# EAGLE design xc6xl9 (EAGLE 7.2.0)
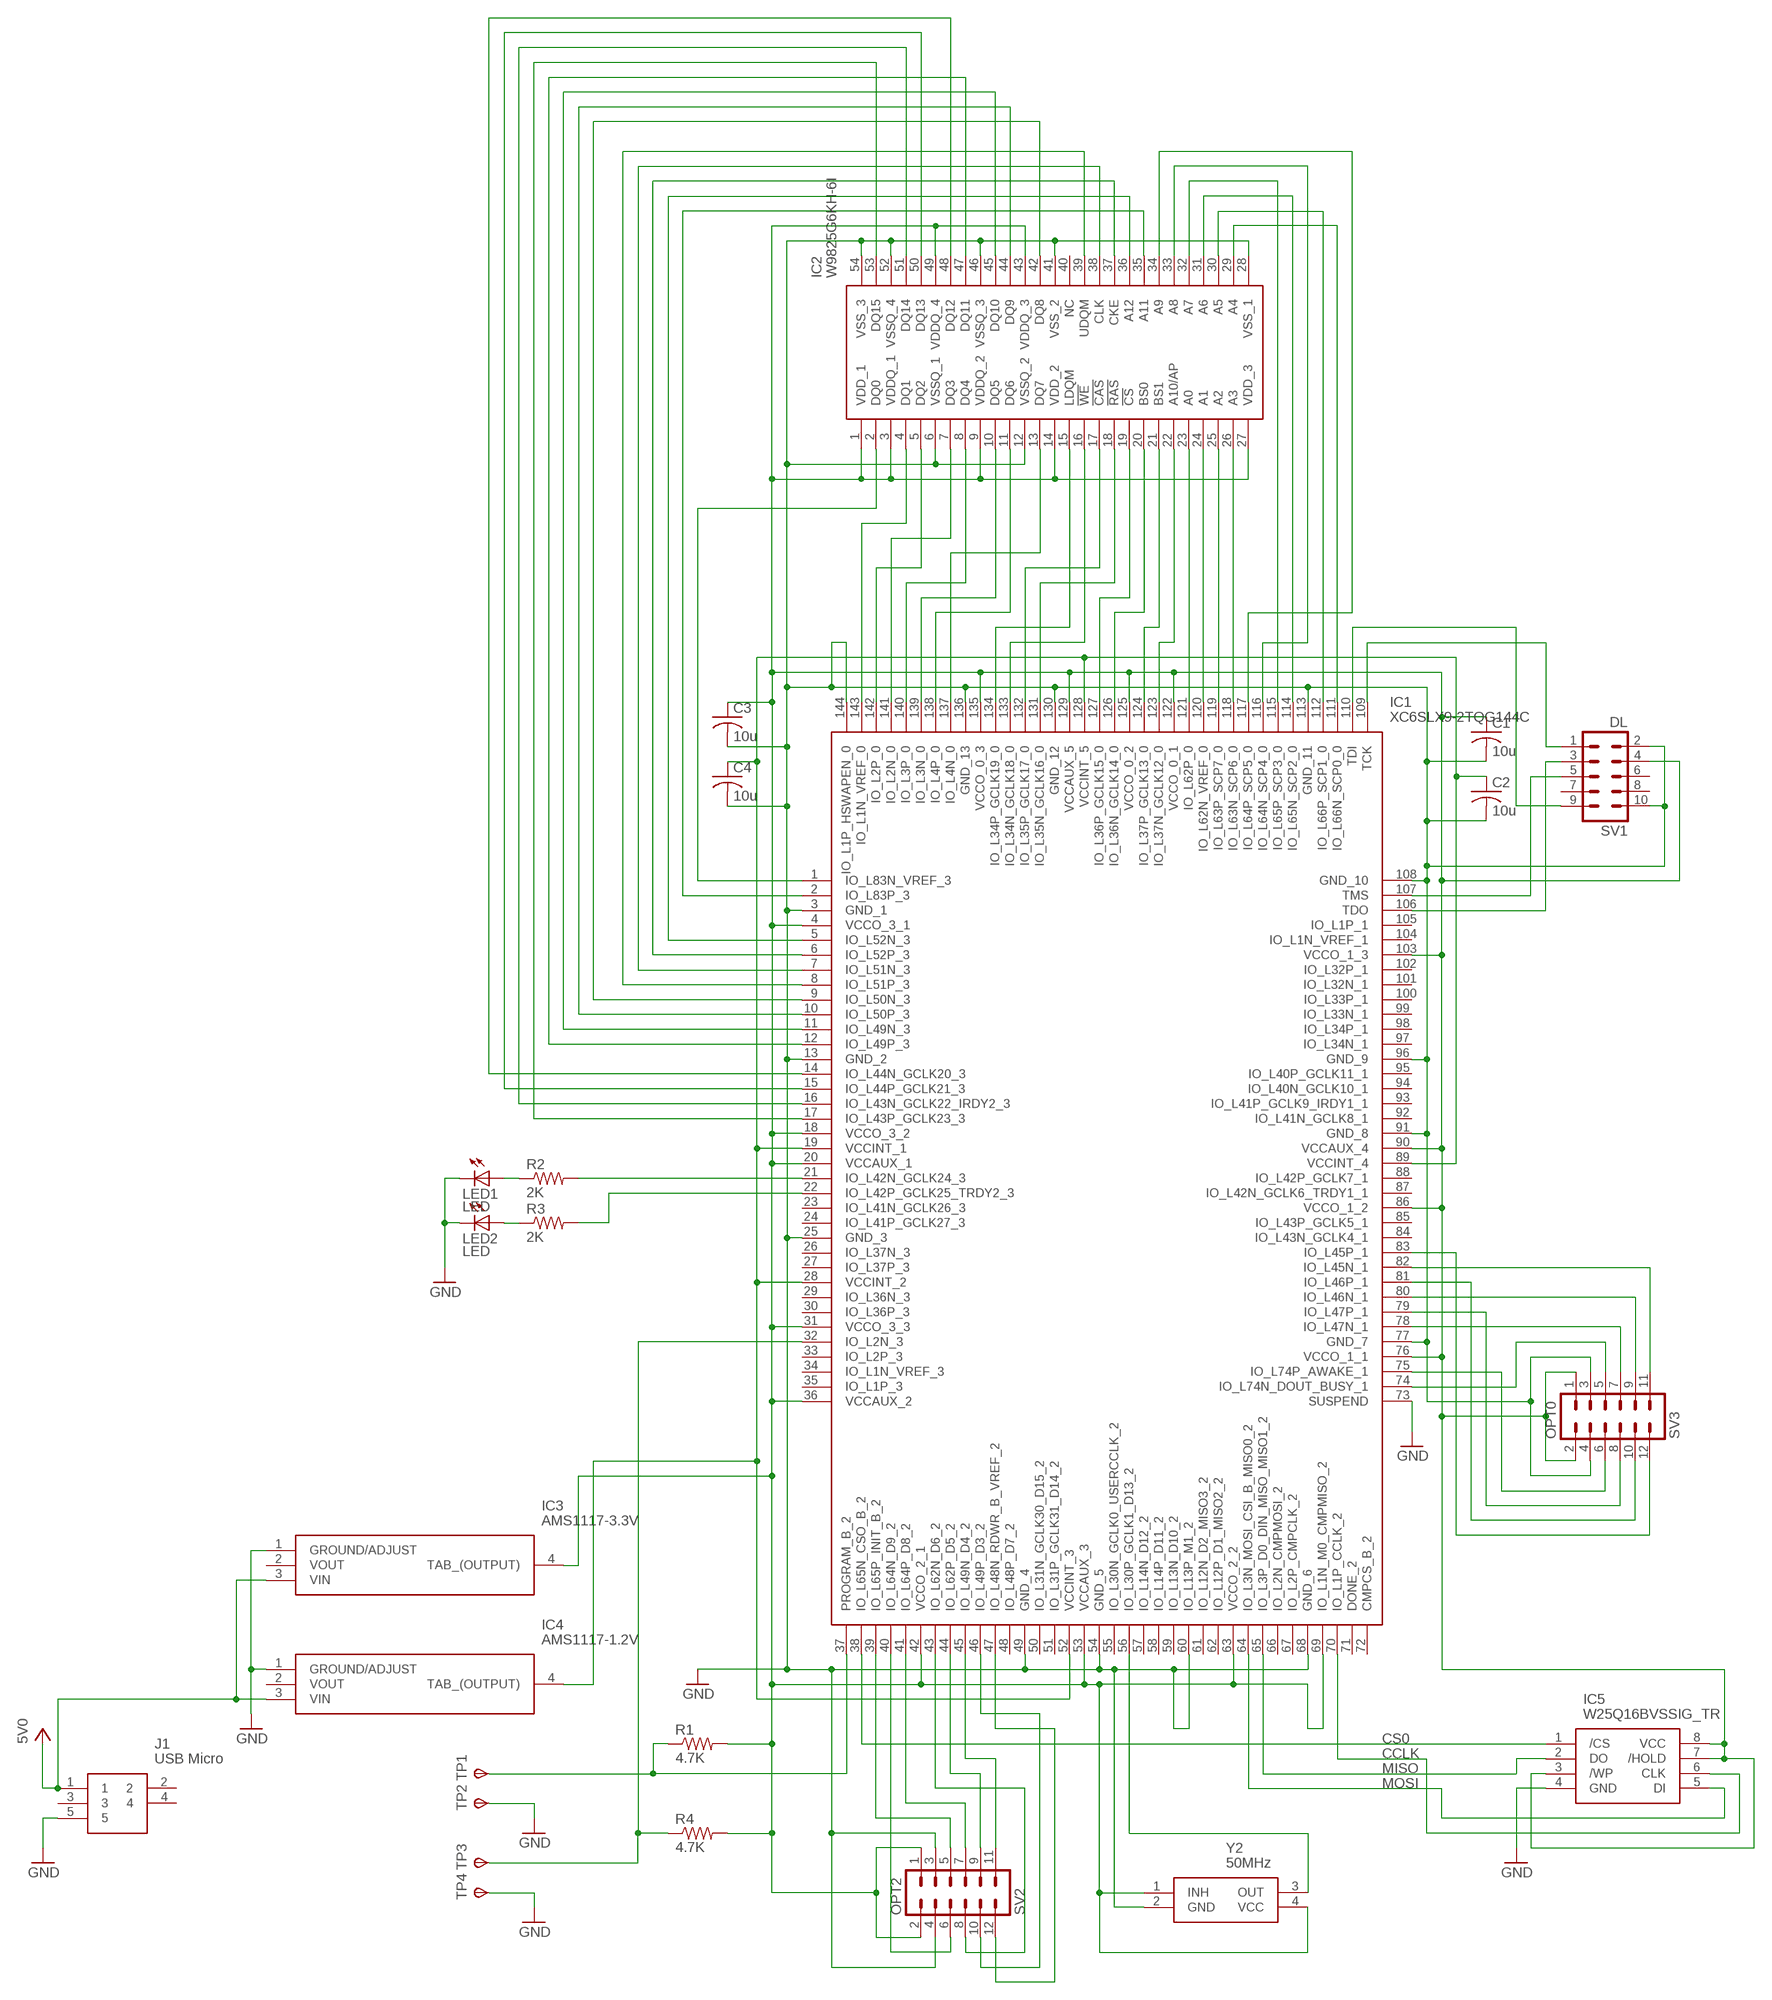
[diagram p0: schematic, sheet 1]

## Parts
C1  10u  C-USC0805K  [C0805K]
C2  10u  C-USC0805K  [C0805K]
C3  10u  C-USC0805K  [C0805K]
C4  10u  C-USC0805K  [C0805K]
IC1  XC6SLX9-2TQG144C  [QFP50P2200X2200X160-144N]
IC2  W9825G6KH-6I  [SOP80P1176X120-54N]
IC3  AMS1117-3.3V  [SOT229P700X180-4N]
IC4  AMS1117-1.2V  AMS1117-3.3V  [SOT229P700X180-4N]
IC5  W25Q16BVSSIG_TR  [SOIC127P790X216-8N]
J1  USB Micro  10104110-0001LF  [10104110-0001LF]
LED1  LED  LEDCHIPLED_0805  [CHIPLED_0805]
LED2  LED  LEDCHIPLED_0805  [CHIPLED_0805]
R1  4.7K  R-US_R0805  [R0805]
R2  2K  R-US_R0805  [R0805]
R3  2K  R-US_R0805  [R0805]
R4  4.7K  R-US_R0805  [R0805]
SV1  DL  MA05-2  [MA05-2]
SV2  OPT2  MA06-2  [MA06-2]
SV3  OPT0  MA06-2  [MA06-2]
TP1  TPSTP10SQ  [TP10SQ]
TP2  TPSTP10SQ  [TP10SQ]
TP3  TPSTP10SQ  [TP10SQ]
TP4  TPSTP10SQ  [TP10SQ]
Y2  50MHz  KC5032A80.0000C10E00  [KC5032A12.0000CM0E00]

## Nets
3V3: C1.1 C3.1 IC1.4(VCCO_3_1) IC1.18(VCCO_3_2) IC1.20(VCCAUX_1) IC1.31(VCCO_3_3) IC1.36(VCCAUX_2) IC1.42(VCCO_2_1) IC1.53(VCCAUX_3) IC1.63(VCCO_2_2) IC1.69(IO_L1N_M0_CMPMISO_2) IC1.76(VCCO_1_1) IC1.86(VCCO_1_2) IC1.90(VCCAUX_4) IC1.103(VCCO_1_3) IC1.122(VCCO_0_1) IC1.125(VCCO_0_2) IC1.129(VCCAUX_5) IC1.135(VCCO_0_3) IC2.1(VDD_1) IC2.3(VDDQ_1) IC2.9(VDDQ_2) IC2.14(VDD_2) IC2.27(VDD_3) IC2.43(VDDQ_3) IC2.49(VDDQ_4) IC3.4(TAB_(OUTPUT)) IC5.3(/WP) IC5.7(/HOLD) IC5.8(VCC) R1.2 R4.2 SV1.4 SV2.1 SV2.2 SV3.1 SV3.2 Y2.1(INH) Y2.4(VCC)
CCLK: IC1.70(IO_L1P_CCLK_2) IC5.6(CLK)
CS0: IC1.38(IO_L65N_CSO_B_2) IC5.1(/CS)
GND: C1.2 C2.2 C3.2 C4.2 IC1.3(GND_1) IC1.13(GND_2) IC1.25(GND_3) IC1.49(GND_4) IC1.54(GND_5) IC1.60(IO_L13P_M1_2) IC1.68(GND_6) IC1.73(SUSPEND) IC1.77(GND_7) IC1.91(GND_8) IC1.96(GND_9) IC1.108(GND_10) IC1.113(GND_11) IC1.130(GND_12) IC1.136(GND_13) IC1.144(IO_L1P_HSWAPEN_0) IC2.6(VSSQ_1) IC2.12(VSSQ_2) IC2.28(VSS_1) IC2.41(VSS_2) IC2.46(VSSQ_3) IC2.52(VSSQ_4) IC2.54(VSS_3) IC3.1(GROUND/ADJUST) IC4.1(GROUND/ADJUST) IC5.4(GND) J1.5 LED1.C LED2.C SV1.2 SV1.10 SV2.3 SV2.4 SV3.3 SV3.4 TP2.TP(PP) TP4.TP(PP) Y2.2(GND)
MISO: IC1.65(IO_L3P_D0_DIN_MISO_MISO1_2) IC5.2(DO)
MOSI: IC1.64(IO_L3N_MOSI_CSI_B_MISO0_2) IC5.5(DI)
N$1: IC1.56(IO_L30P_GCLK1_D13_2) Y2.3(OUT)
N$2: IC1.109(TCK) SV1.1
N$3: IC1.106(TDO) SV1.3
N$4: IC1.107(TMS) SV1.5
N$5: IC1.110(TDI) SV1.9
N$6: IC1.111(IO_L66N_SCP0_0) IC2.29(A4)
N$7: IC1.112(IO_L66P_SCP1_0) IC2.30(A5)
N$8: IC1.114(IO_L65N_SCP2_0) IC2.31(A6)
N$9: IC1.115(IO_L65P_SCP3_0) IC2.32(A7)
N$10: IC1.116(IO_L64N_SCP4_0) IC2.33(A8)
N$11: IC1.21(IO_L42N_GCLK24_3) R2.2
N$12: IC1.22(IO_L42P_GCLK25_TRDY2_3) R3.2
N$13: LED2.A R3.1
N$14: LED1.A R2.1
N$15: IC1.117(IO_L64P_SCP5_0) IC2.34(A9)
N$16: IC1.118(IO_L63N_SCP6_0) IC2.26(A3)
N$17: IC1.119(IO_L63P_SCP7_0) IC2.25(A2)
N$18: IC1.120(IO_L62N_VREF_0) IC2.24(A1)
N$19: IC1.121(IO_L62P_0) IC2.23(A0)
N$20: IC1.123(IO_L37N_GCLK12_0) IC2.22(A10/AP)
N$21: IC1.37(PROGRAM_B_2) R1.1 TP1.TP(PP)
N$22: IC1.124(IO_L37P_GCLK13_0) IC2.21(BS1)
N$23: IC1.126(IO_L36N_GCLK14_0) IC2.20(BS0)
N$24: IC1.127(IO_L36P_GCLK15_0) IC2.19(!CS)
N$25: IC1.131(IO_L35N_GCLK16_0) IC2.18(!RAS)
N$26: IC1.132(IO_L35P_GCLK17_0) IC2.17(!CAS)
N$27: IC1.133(IO_L34N_GCLK18_0) IC2.16(!WE)
N$28: IC1.134(IO_L34P_GCLK19_0) IC2.15(LDQM)
N$29: IC1.137(IO_L4N_0) IC2.13(DQ7)
N$30: IC1.138(IO_L4P_0) IC2.11(DQ6)
N$31: IC1.139(IO_L3N_0) IC2.10(DQ5)
N$32: IC1.140(IO_L3P_0) IC2.8(DQ4)
N$33: IC1.141(IO_L2N_0) IC2.7(DQ3)
N$34: IC1.142(IO_L2P_0) IC2.5(DQ2)
N$35: IC1.143(IO_L1N_VREF_0) IC2.4(DQ1)
N$36: IC1.2(IO_L83P_3) IC2.35(A11)
N$37: IC1.5(IO_L52N_3) IC2.36(A12)
N$38: IC1.6(IO_L52P_3) IC2.37(CKE)
N$39: IC1.7(IO_L51N_3) IC2.38(CLK)
N$40: IC1.8(IO_L51P_3) IC2.39(UDQM)
N$41: IC1.32(IO_L2N_3) R4.1 TP3.TP(PP)
N$42: IC1.9(IO_L50N_3) IC2.42(DQ8)
N$43: IC1.10(IO_L50P_3) IC2.44(DQ9)
N$44: IC1.11(IO_L49N_3) IC2.45(DQ10)
N$45: IC1.12(IO_L49P_3) IC2.47(DQ11)
N$46: IC1.17(IO_L43P_GCLK23_3) IC2.53(DQ15)
N$47: IC1.16(IO_L43N_GCLK22_IRDY2_3) IC2.51(DQ14)
N$48: IC1.15(IO_L44P_GCLK21_3) IC2.50(DQ13)
N$49: IC1.14(IO_L44N_GCLK20_3) IC2.48(DQ12)
N$52: IC1.74(IO_L74N_DOUT_BUSY_1) SV3.5
N$53: IC1.75(IO_L74P_AWAKE_1) SV3.6
N$54: IC1.78(IO_L47N_1) SV3.7
N$55: IC1.79(IO_L47P_1) SV3.8
N$56: IC1.80(IO_L46N_1) SV3.9
N$57: IC1.82(IO_L45N_1) SV3.11
N$58: IC1.81(IO_L46P_1) SV3.10
N$59: IC1.83(IO_L45P_1) SV3.12
N$60: IC1.39(IO_L65P_INIT_B_2) SV2.5
N$61: IC1.40(IO_L64N_D9_2) SV2.6
N$62: IC1.41(IO_L64P_D8_2) SV2.7
N$63: IC1.43(IO_L62N_D6_2) SV2.8
N$64: IC1.44(IO_L62P_D5_2) SV2.9
N$65: IC1.46(IO_L49P_D3_2) SV2.10
N$66: IC1.45(IO_L49N_D4_2) SV2.11
N$67: IC1.47(IO_L48N_RDWR_B_VREF_2) SV2.12
N$68: IC1.1(IO_L83N_VREF_3) IC2.2(DQ0)
VCC: IC3.3(VIN) IC4.3(VIN) J1.1 ; supply symbol labelled 5V0
VCCINT: C2.1 C4.1 IC1.19(VCCINT_1) IC1.28(VCCINT_2) IC1.52(VCCINT_3) IC1.89(VCCINT_4) IC1.128(VCCINT_5) IC4.4(TAB_(OUTPUT))
Unconnected: IC1.23(IO_L41N_GCLK26_3) IC1.24(IO_L41P_GCLK27_3) IC1.26(IO_L37N_3) IC1.27(IO_L37P_3) IC1.29(IO_L36N_3) IC1.30(IO_L36P_3) IC1.33(IO_L2P_3) IC1.34(IO_L1N_VREF_3) IC1.35(IO_L1P_3) IC1.48(IO_L48P_D7_2) IC1.50(IO_L31N_GCLK30_D15_2) IC1.51(IO_L31P_GCLK31_D14_2) IC1.55(IO_L30N_GCLK0_USERCCLK_2) IC1.57(IO_L14N_D12_2) IC1.58(IO_L14P_D11_2) IC1.59(IO_L13N_D10_2) IC1.61(IO_L12N_D2_MISO3_2) IC1.62(IO_L12P_D1_MISO2_2) IC1.66(IO_L2N_CMPMOSI_2) IC1.67(IO_L2P_CMPCLK_2) IC1.71(DONE_2) IC1.72(CMPCS_B_2) IC1.84(IO_L43N_GCLK4_1) IC1.85(IO_L43P_GCLK5_1) IC1.87(IO_L42N_GCLK6_TRDY1_1) IC1.88(IO_L42P_GCLK7_1) IC1.92(IO_L41N_GCLK8_1) IC1.93(IO_L41P_GCLK9_IRDY1_1) IC1.94(IO_L40N_GCLK10_1) IC1.95(IO_L40P_GCLK11_1) IC1.97(IO_L34N_1) IC1.98(IO_L34P_1) IC1.99(IO_L33N_1) IC1.100(IO_L33P_1) IC1.101(IO_L32N_1) IC1.102(IO_L32P_1) IC1.104(IO_L1N_VREF_1) IC1.105(IO_L1P_1) IC2.40(NC) IC3.2(VOUT) IC4.2(VOUT) J1.2 J1.3 J1.4 SV1.6 SV1.7 SV1.8

## Library data of the parts
C1-C4 = adafruit:C-US: CAPACITOR, American symbol
IC1 = XC6SLX9-2TQG144C:XC6SLX9-2TQG144C: FPGA Spartan-6 9152 logic cells TQFP144 XC6SLX9-2TQG144C, FPGA Spartan-6 9152 Cells, 576kbit, 5720 Blocks, 144-Pin TQFP Source: Datasheet <https://www.xilinx.com/support/documentation/data_sheets/ds160.pdf>; DESCRIPTION: FPGA Spartan-6 9152 logic cells TQFP144 XC6SLX9-2TQG144C, FPGA Spartan-6 9152 Cells, 576kbit, 5720 Blocks, 144-Pin TQFP; HEIGHT: 1.6mm; MANUFACTURER_NAME: XILINX; MANUFACTURER_PART_NUMBER: XC6SLX9-2TQG144C; MOUSER_PART_NUMBER: 1732079; MOUSER_PRICE-STOCK: http://uk.rs-online.com/web/p/products/1732079; RS_PART_NUMBER: 1732079; RS_PRICE-STOCK: http://uk.rs-online.com/web/p/products/1732079
IC2 = W9825G6KH-6I:W9825G6KH-6I: Winbond W9825G6KH-6I, SDRAM 256Mbit Surface Mount, 166MHz, 54-Pin TSOP Source: Datasheet <http://www.winbond.com/resource-files/w9825g6kh_a04.pdf>; DESCRIPTION: Winbond W9825G6KH-6I, SDRAM 256Mbit Surface Mount, 166MHz, 54-Pin TSOP; HEIGHT: 1.2mm; MANUFACTURER_NAME: Winbond; MANUFACTURER_PART_NUMBER: W9825G6KH-6I; MOUSER_PART_NUMBER: 454-W9825G6KH-6I; MOUSER_PRICE-STOCK: https://www.mouser.com/Search/Refine.aspx?Keyword=454-W9825G6KH-6I; RS_PART_NUMBER: 1882632; RS_PRICE-STOCK: http://uk.rs-online.com/web/p/products/1882632
IC3 IC4 = ams1117-3.3v:AMS1117-3.3V: 1A LOW DROPOUT VOLTAGE REGULATOR, SOT-223 Source: Datasheet <http://www.advanced-monolithic.com/pdf/ds1117.pdf>; DESCRIPTION: 1A LOW DROPOUT VOLTAGE REGULATOR, SOT-223; HEIGHT: 1.8mm; MANUFACTURER_NAME: Advanced Monolithic Systems; MANUFACTURER_PART_NUMBER: ams1117-3.3v
IC5 = W25Q16BVSSIG_TR:W25Q16BVSSIG_TR: IC FLASH 16M SPI 104MHZ 8SOIC Source: Datasheet <https://media.digikey.com/pdf/Data Sheets/Winbond PDFs/W25Q16BV.pdf>; ARROW_PART_NUMBER: W25Q16BVSSIG TR; DESCRIPTION: IC FLASH 16M SPI 104MHZ 8SOIC; HEIGHT: 2.16mm; MANUFACTURER_NAME: Winbond; MANUFACTURER_PART_NUMBER: W25Q16BVSSIG TR; MOUSER_PART_NUMBER: N/A; MOUSER_PRICE-STOCK: https://www.mouser.co.uk/ProductDetail/Winbond/W25Q16BVSSIG-TR?qs=rkhjVJ6%2F3EKjTa61MhmWkw%3D%3D
J1 = USB-Micro_3:10104110-0001LF: USB Connectors 5P Quick Connect Micro USB TypeB Rcpt Source: Datasheet <http://docs-emea.rs-online.com/webdocs/0ed1/0900766b80ed1ae6.pdf>; ALLIED_NUMBER: 70236824; ALLIED_PRICE-STOCK: http://www.alliedelec.com/fci-10104110-0001lf/70236824/; ARROW_PART_NUMBER: 10104110-0001LF; ARROW_PRICE-STOCK: https://www.arrow.com/en/products/10104110-0001lf/amphenol-fci; DESCRIPTION: USB Connectors 5P Quick Connect Micro USB TypeB Rcpt; HEIGHT: mm; MANUFACTURER_NAME: FCI; MANUFACTURER_PART_NUMBER: 10104110-0001LF; RS_PART_NUMBER: 1738645; RS_PRICE-STOCK: http://uk.rs-online.com/web/p/products/1738645
LED1 LED2 = adafruit:LED: LED OSRAM: - CHIPLED LG R971, LG N971, LY N971, LG Q971, LY Q971, LO R971, LY R971 LH N974, LH R974 LS Q976, LO Q976, LY Q976 LO Q996 - Hyper CHIPLED LW Q18S LB Q993, LB Q99A, LB R99A - SideLED LS A670, LO A670, LY A670, LG A670, LP A670 LB A673, LV A673, LT A673, LW A673 LH A674 LY A675 LS A676, LA A676, LO A676, LY A676, LW A676 LS A679, LY A679, LG A679 - Hyper Micro SIDELED® LS Y876, LA Y876, LO Y876, LY Y876 LT Y87S - SmartLED LW L88C, LW L88S LB L89C, LB L89S, LG L890 LS L89K, LO L89K, LY L89K LS L896, LA L896, LO L896, LY L896 - TOPLED LS T670, LO T670, LY T670, LG T670, LP T670 LSG T670, LSP T670, LSY T670, LOP T670, LYG T670 LG T671, LOG T671, LSG T671 LB T673, LV T673, LT T673, LW T673 LH T674 LS T676, LA T676, LO T676, LY T676, LB T676, LH T676, LSB T676, LW T676 LB T67C, LV T67C, LT T67C, LS T67K, LO T67K, LY T67K, LW E67C LS E67B, LA E67B, LO E67B, LY E67B, LB E67C, LV E67C, LT E67C LW T67C LS T679, LY T679, LG T679 LS T770, LO T770, LY T770, LG T770, LP T770 LB T773, LV T773, LT T773, LW T773 LH T774 LS E675, LA E675, LY E675, LS T675 LS T776, LA T776, LO T776, LY T776, LB T776 LHGB T686 LT T68C, LB T68C - Hyper Mini TOPLED® LB M676 - Mini TOPLED Santana® LG M470 LS M47K, LO M47K, LY M47K Source: http://www.osram.convergy.de/
R1-R4 = adafruit:R-US_: RESISTOR, American symbol
SV1 = con-lstb:MA05-2: PIN HEADER; OC_FARNELL: unknown; OC_NEWARK: unknown
SV2 SV3 = con-lstb:MA06-2: PIN HEADER; OC_FARNELL: unknown; OC_NEWARK: unknown
TP1-TP4 = testpad:TPS: TEST PIN
Y2 = OSC_KC5032A80.0000C10E00:KC5032A80.0000C10E00: KC5032A80.0000C10E00, Crystal Oscillator, 80 MHz, 50ppm CMOS 15pF, 4-Pin CSMD, 5 x 3.2 x 1mm Source: Datasheet <http://uk.rs-online.com/web/p/products/1110767>; DESCRIPTION: KC5032A80.0000C10E00, Crystal Oscillator, 80 MHz, 50ppm CMOS 15pF, 4-Pin CSMD, 5 x 3.2 x 1mm; HEIGHT: mm; MANUFACTURER_NAME: KYOCERA; MANUFACTURER_PART_NUMBER: KC5032A80.0000C10E00; MOUSER_PART_NUMBER: 1110767P; MOUSER_PRICE-STOCK: http://uk.rs-online.com/web/p/products/1110767P; RS_PART_NUMBER: 1110767P; RS_PRICE-STOCK: http://uk.rs-online.com/web/p/products/1110767P

## Net classes
0 default: width 0.25 mm, clearance 0.004 mm

## Board
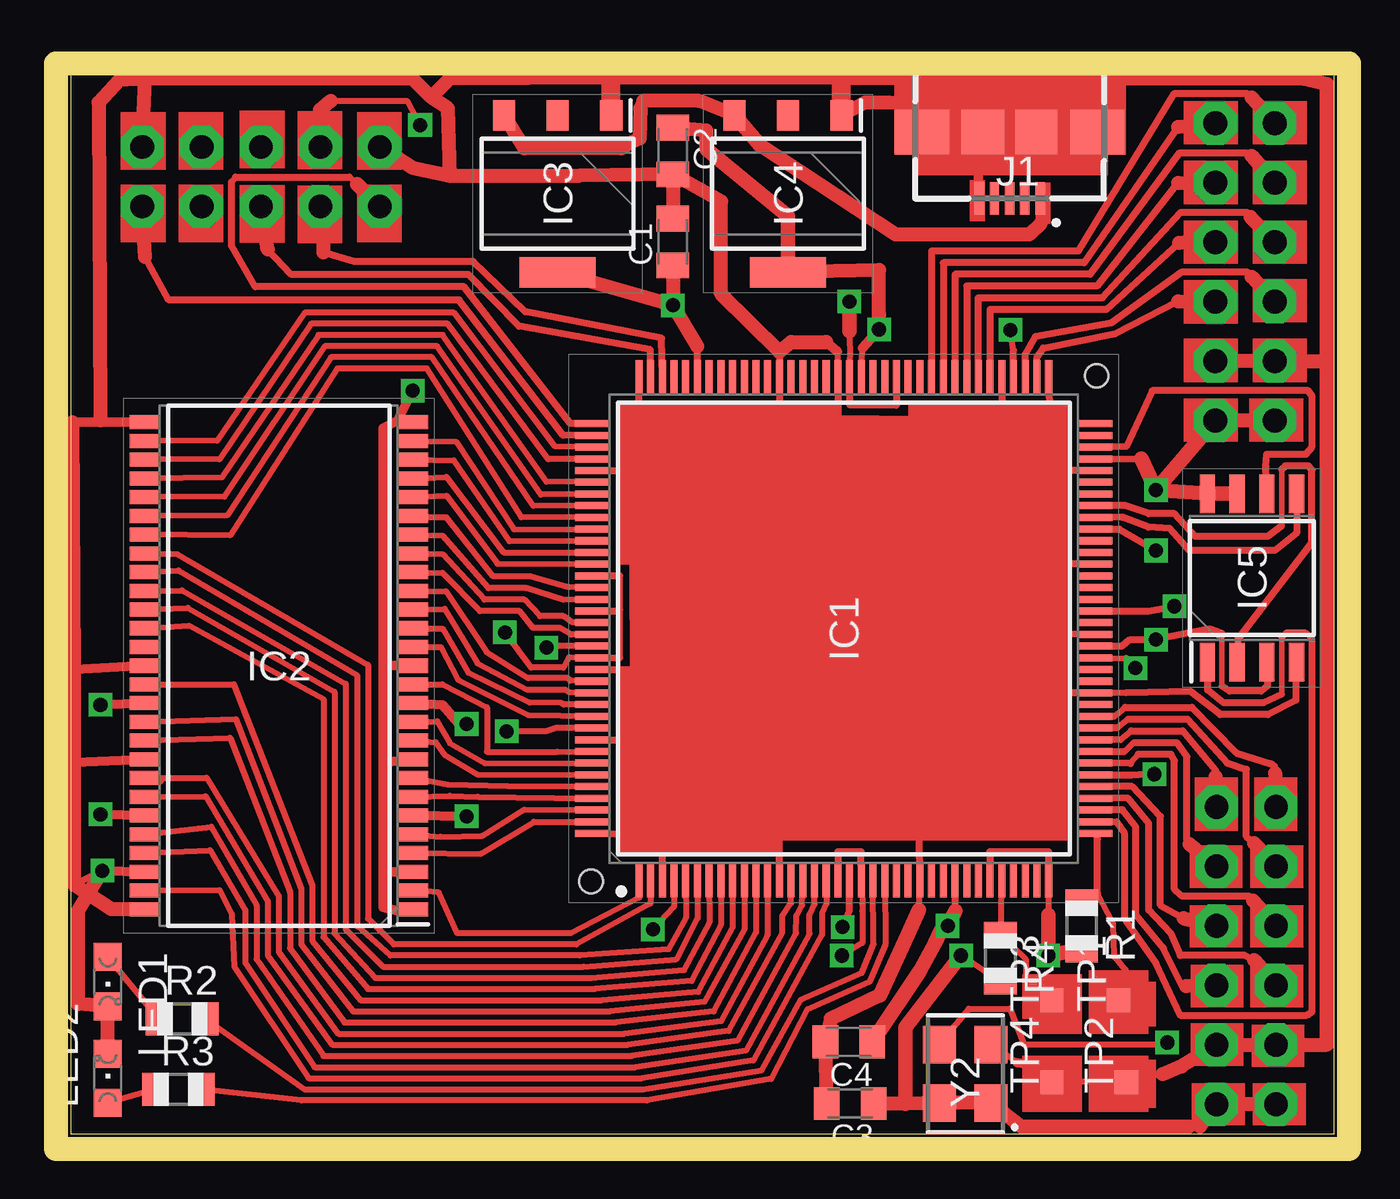
[diagram p1: board, top side]
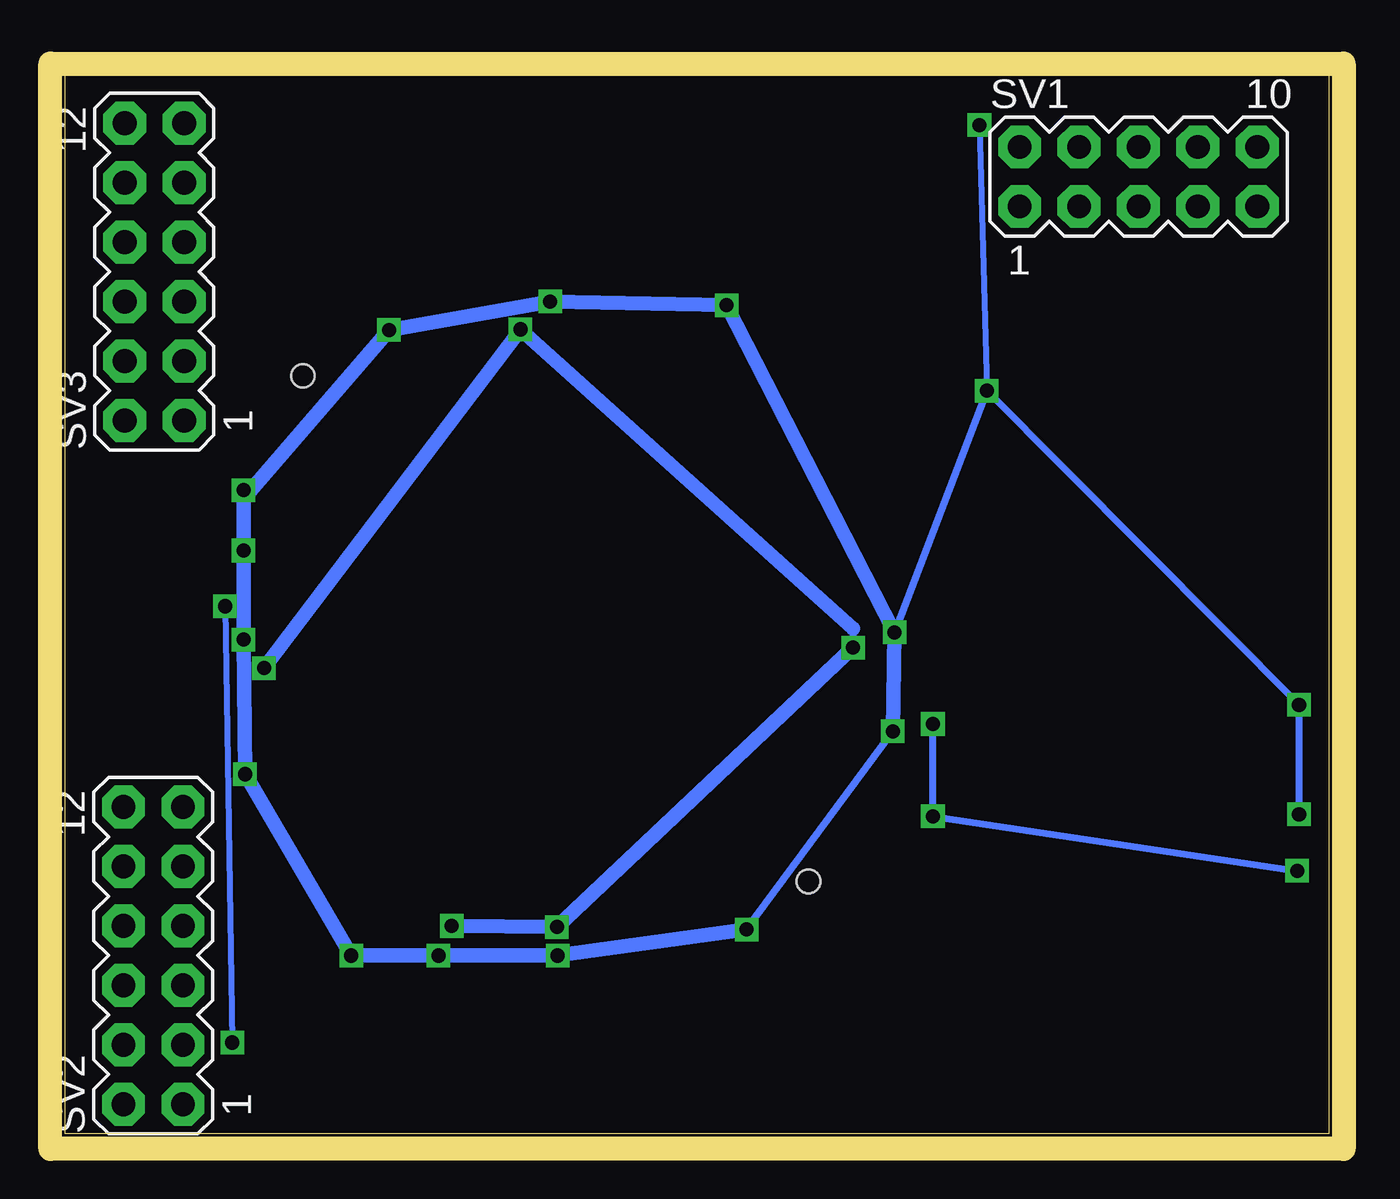
[diagram p2: board, bottom side, seen from below]

Size 53.97 x 45.24 mm. Coordinates in mm from the lower left corner, seen from the top.
Outline: 53.97,0 53.97,45.24 0,45.24 0,0 53.97,0
Copper layers (1*16): Top 0.035mm / dielectric 1.5mm / Bottom 0.035mm
Design rules "smd_default": minimum track width 10mil, minimum drill 24mil, track to track 6mil, track to pad 6mil, pad to pad 6mil, via to via 6mil, smd to smd 6mil, copper to edge 40mil, drill to drill 8mil, minimum pad ring 10mil, minimum via ring 8mil, stop-mask expansion 4mil, vias tented up to drill 0mil, thermal gap 10mil
Holes 1 mm at 22.22,10.8 43.81,32.38
Milling: 4 lines

### Footprints (pad centres in the part's own frame; a part is rotated, then mirrored left to right if it is on the bottom)
C0805K = smd 1.1 x 1.4: 1 -1,0; 2 1,0
QFP50P2200X2200X160-144N = smd 1.475 x 0.3: 1 -10.738,8.75; 2 -10.738,8.25; 3 -10.738,7.75; 4 -10.738,7.25; 5 -10.738,6.75; 6 -10.738,6.25; 7 -10.738,5.75; 8 -10.738,5.25; 9 -10.738,4.75; 10 -10.738,4.25; 11 -10.738,3.75; 12 -10.738,3.25; 13 -10.738,2.75; 14 -10.738,2.25; 15 -10.738,1.75; 16 -10.738,1.25; 17 -10.738,0.75; 18 -10.738,0.25; 19 -10.738,-0.25; 20 -10.738,-0.75; 21 -10.738,-1.25; 22 -10.738,-1.75; 23 -10.738,-2.25; 24 -10.738,-2.75; 25 -10.738,-3.25; 26 -10.738,-3.75; 27 -10.738,-4.25; 28 -10.738,-4.75; 29 -10.738,-5.25; 30 -10.738,-5.75; 31 -10.738,-6.25; 32 -10.738,-6.75; 33 -10.738,-7.25; 34 -10.738,-7.75; 35 -10.738,-8.25; 36 -10.738,-8.75; 73 10.738,-8.75; 74 10.738,-8.25; 75 10.738,-7.75; 76 10.738,-7.25; 77 10.738,-6.75; 78 10.738,-6.25; 79 10.738,-5.75; 80 10.738,-5.25; 81 10.738,-4.75; 82 10.738,-4.25; 83 10.738,-3.75; 84 10.738,-3.25; 85 10.738,-2.75; 86 10.738,-2.25; 87 10.738,-1.75; 88 10.738,-1.25; 89 10.738,-0.75; 90 10.738,-0.25; 91 10.738,0.25; 92 10.738,0.75; 93 10.738,1.25; 94 10.738,1.75; 95 10.738,2.25; 96 10.738,2.75; 97 10.738,3.25; 98 10.738,3.75; 99 10.738,4.25; 100 10.738,4.75; 101 10.738,5.25; 102 10.738,5.75; 103 10.738,6.25; 104 10.738,6.75; 105 10.738,7.25; 106 10.738,7.75; 107 10.738,8.25; 108 10.738,8.75 | smd 0.3 x 1.475: 37 -8.75,-10.738; 38 -8.25,-10.738; 39 -7.75,-10.738; 40 -7.25,-10.738; 41 -6.75,-10.738; 42 -6.25,-10.738; 43 -5.75,-10.738; 44 -5.25,-10.738; 45 -4.75,-10.738; 46 -4.25,-10.738; 47 -3.75,-10.738; 48 -3.25,-10.738; 49 -2.75,-10.738; 50 -2.25,-10.738; 51 -1.75,-10.738; 52 -1.25,-10.738; 53 -0.75,-10.738; 54 -0.25,-10.738; 55 0.25,-10.738; 56 0.75,-10.738; 57 1.25,-10.738; 58 1.75,-10.738; 59 2.25,-10.738; 60 2.75,-10.738; 61 3.25,-10.738; 62 3.75,-10.738; 63 4.25,-10.738; 64 4.75,-10.738; 65 5.25,-10.738; 66 5.75,-10.738; 67 6.25,-10.738; 68 6.75,-10.738; 69 7.25,-10.738; 70 7.75,-10.738; 71 8.25,-10.738; 72 8.75,-10.738; 109 8.75,10.738; 110 8.25,10.738; 111 7.75,10.738; 112 7.25,10.738; 113 6.75,10.738; 114 6.25,10.738; 115 5.75,10.738; 116 5.25,10.738; 117 4.75,10.738; 118 4.25,10.738; 119 3.75,10.738; 120 3.25,10.738; 121 2.75,10.738; 122 2.25,10.738; 123 1.75,10.738; 124 1.25,10.738; 125 0.75,10.738; 126 0.25,10.738; 127 -0.25,10.738; 128 -0.75,10.738; 129 -1.25,10.738; 130 -1.75,10.738; 131 -2.25,10.738; 132 -2.75,10.738; 133 -3.25,10.738; 134 -3.75,10.738; 135 -4.25,10.738; 136 -4.75,10.738; 137 -5.25,10.738; 138 -5.75,10.738; 139 -6.25,10.738; 140 -6.75,10.738; 141 -7.25,10.738; 142 -7.75,10.738; 143 -8.25,10.738; 144 -8.75,10.738
SOP80P1176X120-54N = smd 1.295 x 0.6: 1 -5.728,10.4; 2 -5.728,9.6; 3 -5.728,8.8; 4 -5.728,8; 5 -5.728,7.2; 6 -5.728,6.4; 7 -5.728,5.6; 8 -5.728,4.8; 9 -5.728,4; 10 -5.728,3.2; 11 -5.728,2.4; 12 -5.728,1.6; 13 -5.728,0.8; 14 -5.728,0; 15 -5.728,-0.8; 16 -5.728,-1.6; 17 -5.728,-2.4; 18 -5.728,-3.2; 19 -5.728,-4; 20 -5.728,-4.8; 21 -5.728,-5.6; 22 -5.728,-6.4; 23 -5.728,-7.2; 24 -5.728,-8; 25 -5.728,-8.8; 26 -5.728,-9.6; 27 -5.728,-10.4; 28 5.728,-10.4; 29 5.728,-9.6; 30 5.728,-8.8; 31 5.728,-8; 32 5.728,-7.2; 33 5.728,-6.4; 34 5.728,-5.6; 35 5.728,-4.8; 36 5.728,-4; 37 5.728,-3.2; 38 5.728,-2.4; 39 5.728,-1.6; 40 5.728,-0.8; 41 5.728,0; 42 5.728,0.8; 43 5.728,1.6; 44 5.728,2.4; 45 5.728,3.2; 46 5.728,4; 47 5.728,4.8; 48 5.728,5.6; 49 5.728,6.4; 50 5.728,7.2; 51 5.728,8; 52 5.728,8.8; 53 5.728,9.6; 54 5.728,10.4
SOT229P700X180-4N = smd 1.3 x 0.95: 1 -3.35,2.29; 2 -3.35,0; 3 -3.35,-2.29 | smd 1.3 x 3.25: 4 3.35,0
SOIC127P790X216-8N = smd 1.65 x 0.65: 1 -3.6,1.905; 2 -3.6,0.635; 3 -3.6,-0.635; 4 -3.6,-1.905; 5 3.6,-1.905; 6 3.6,-0.635; 7 3.6,0.635; 8 3.6,1.905
10104110-0001LF = smd 0.4 x 1.4: 1 2.73,5.6; 2 3.38,5.6; 3 4.03,5.6; 4 4.68,5.6; 5 5.33,5.6 | smd 2.3 x 1.9: 6 0.28,2.75; 7 7.78,2.75 | smd 1.8 x 1.9: 8 2.88,2.75; 9 5.18,2.75
CHIPLED_0805 = smd 1.2 x 1.2: A 0,-1.05; C 0,1.05
R0805 = smd 1.1 x 1.4: 1 -1,0; 2 1,0
MA05-2 = drill 1.016 octagon: 1 -5.08,-1.27; 2 -5.08,1.27; 3 -2.54,-1.27; 4 -2.54,1.27; 5 0,-1.27; 6 0,1.27; 7 2.54,-1.27; 8 2.54,1.27; 9 5.08,-1.27; 10 5.08,1.27
MA06-2 = drill 1.016 octagon: 1 -6.35,-1.27; 2 -6.35,1.27; 3 -3.81,-1.27; 4 -3.81,1.27; 5 -1.27,-1.27; 6 -1.27,1.27; 7 1.27,-1.27; 8 1.27,1.27; 9 3.81,-1.27; 10 3.81,1.27; 11 6.35,-1.27; 12 6.35,1.27
TP10SQ = smd 1 x 1: TP 0,0
KC5032A12.0000CM0E00 = smd 1.6 x 1.4: 1 -1.25,-1.1; 2 1.25,-1.1; 3 1.25,1.1; 4 -1.25,1.1

### Placement (x,y rotation side)
C1  25.72,38.1 90 top
C2  25.72,41.99 270 top
C3  33.29,1.3 180 top
C4  33.24,3.93 180 top
IC1  33.02,21.59 90 top
IC2  8.89,20 180 top
IC3  20.8,40.16 270 top
IC4  30.64,40.16 270 top
IC5  50.45,23.75 90 top
J1  44.13,45.56 180 top
LED1  1.59,6.51 180 top
LED2  1.59,2.38 0 top
R1  43.18,8.89 270 top
R2  4.76,4.92 0 top
R3  4.6,1.91 0 top
R4  39.71,7.51 270 top
SV1  8.13,40.89 0 bottom
SV2  50.21,7.62 90 bottom
SV3  50.16,36.83 90 bottom
TP1  44.77,5.71 90 top
TP2  45.08,2.22 90 top
TP3  41.91,5.71 90 top
TP4  41.91,2.22 90 top
Y2  38.21,2.57 90 top

### Tracks (layer width: path | path; a pad name or v marks a point on that pad's centre or on a via)
3V3  (via drill 0.6)
  Top 0.225: 49.17,19.13 49.17,21.38
  Top 0.25: SV1.4 10.64,43.74 | 11.11,44.13 14.37,44.13 v14.92,43.1 | 40.27,33.47 v40.14,34.34 | v18.55,21.43 19.67,19.92 21.04,19.92 21.29,20.37 IC1.129 | IC1.36 41.75,9.37 | 33.3,33.46 33.26,34.29 | IC1.20 33.81,9.84 33.81,9.52 | v18.62,17.2 20.29,17.2 20.74,17.34 IC1.135
  Top 0.254: IC1.4 25.77,9.7 v24.86,8.73 | 33.76,12.06 32.77,12.06 | 33.81,9.52 33.81,8.16 v32.94,7.62 | 47.76,0.32 48.24,0.33 | R4.2 v38.03,7.62 | IC1.90 33.3,33.46
  Top 0.3: IC2.1 13.97,9.52 | 13.97,30.48 IC2.27 | IC5.3 51.1,19.13 50.85,18.91 49.49,18.92 49.17,19.13 | 49.17,21.38 48.63,21.56 v46.35,21.11 45.24,21.11 44.93,20.85 IC1.53 | IC1.76 40.27,33.47 | 23.44,23.84 IC1.122 | IC1.125 23.42,22.33 | IC1.36 41.78,12.05 | 39.26,12.06 IC1.31 | IC1.69 45.72,28.84 | IC1.63 44.77,25.84 v46.35,24.92 | IC1.86 35.27,31.11 | 33.28,31.14 IC1.90 | IC1.103 26.77,33.64 | IC1.20 33.76,12.06 | 32.77,12.06 IC1.18 | IC1.129 23.44,20.34 | IC1.42 45.32,15.33 45.62,15.36 v46.3,15.37
  Top 0.305: 23.44,20.34 23.44,22.38 | 23.44,22.38 23.44,23.84 | 23.42,22.33 23.44,22.38 | 41.78,12.05 39.26,12.06 | 35.27,31.11 33.28,31.14
  Top 0.406: 13.97,9.52 13.34,9.68 13.34,11.19 | 13.34,11.19 13.34,15.88 | 13.34,15.88 13.34,20 | 13.34,20 13.34,30.16 13.97,30.48 v14.6,31.75 | IC2.3 13.34,11.19 | IC2.9 13.34,15.88 | IC2.14 13.34,20 | IC2.49 v1.27,13.65 | v1.27,18.34 IC2.43
  Top 0.6: 10.64,43.74 11.11,44.13 | SV3.2 SV3.1 | SV2.2 SV2.1 48.24,0.33 | 26.77,33.64 v25.72,35.4 C1.1 | 35.65,1.29 Y2.4 Y2.1 40.59,0.32 47.76,0.32
  Top 0.61: IC5.7 IC5.8 v46.35,27.5 | 41.75,9.37 v41.75,7.62 R1.2 | 33.26,34.29 v33.26,35.56 | 45.72,28.84 v46.35,27.5 | v38.03,7.62 35.65,4.56 35.65,1.29 C3.1 | v25.72,35.4 IC3.4 | SV3.1 v46.35,27.5
  Bottom 0.25: v14.92,43.1 v14.6,31.75
  Bottom 0.3: v1.27,13.65 v1.27,18.34 v14.6,31.75 v18.55,21.43 | v24.86,8.73 v18.62,17.2
  Bottom 0.61: v46.35,27.5 v46.35,24.92 v46.35,21.11 v46.3,15.37 v41.75,7.62 v38.03,7.62 v32.94,7.62 v24.86,8.73 | 46.35,27.15 v40.14,34.34 v33.26,35.56 v25.72,35.4 v18.55,21.43 v18.62,17.2
CCLK
  Top 0.3: IC5.6 51.05,28.52 51.09,29.04 52.76,29.04 53.02,29.37 53.02,31.51 52.86,31.75 46.2,31.75 45.08,29.37 IC1.70
CS0
  Top 0.225: 51.72,21.18 51.72,18.78
  Top 0.25: 53.02,21.12 52.75,21.41 51.91,21.41 51.72,21.18
  Top 0.3: IC1.38 44.67,13.34 44.99,12.87 44.99,9.22 46.35,7.3 47.39,5.07 52.79,5.07 53.02,5.24 53.02,21.12 | 51.72,18.78 50.95,18.42 49.24,18.42 48.56,18.96 IC5.1
GND  (via drill 0.6)
  Top 0.25: 45.08,18.84 IC1.49 | 32.75,33.43 32.77,32.43 | 16.57,17.53 v16.91,17.52 | 46.64,2.55 TP2.TP TP4.TP 41.86,2.87
  Top 0.254: 40.43,3.04 Y2.2 | 36.22,9.57 IC1.25
  Top 0.3: IC1.3 25.27,12.12 | 25.27,12.12 30.27,12.7 | 30.27,12.7 36.26,12.7 | 36.26,12.7 42.55,12.7 42.55,18.84 | 42.55,18.84 42.55,21.35 | 42.55,21.35 42.55,24.34 | 42.55,24.34 42.55,28.34 | 42.55,28.34 42.55,31.11 41.8,31.11 | 41.8,31.11 39.77,30.48 | 39.77,30.48 32.78,30.56 | 32.78,30.56 30.27,31.12 | 30.27,31.12 24.26,31.11 | 24.26,31.11 23.49,31.11 23.97,28.34 | 23.97,28.34 24.02,19.84 | 24.02,19.84 23.49,16.83 | 23.49,16.83 23.49,12.82 | 23.49,12.82 23.49,12.06 25.27,12.12 | IC1.13 30.27,12.7 | IC1.25 36.26,12.7 | IC1.49 42.55,18.84 | IC1.54 42.55,21.35 | IC1.73 41.8,31.11 | IC1.77 39.77,30.48 | IC1.91 32.78,30.56 | 30.27,31.12 IC1.96 30.27,33.42 | IC1.108 24.26,31.11 | IC1.113 23.97,28.34 | IC1.130 24.02,19.84 | IC1.136 23.49,16.83 | v1.35,11.24 0.16,10.64 | 1.27,30.48 0.08,30.4 | IC1.68 42.55,28.34 | 45.08,18.84 47.83,18.9 49.09,17.92 51.14,17.92 52.33,18.53 IC5.4 | IC1.60 42.55,24.34 | IC1.144 23.49,12.82
  Top 0.406: 0.08,30.4 IC2.28 | IC2.41 0.16,19.84 | IC2.46 0.16,15.88 | IC2.52 v1.35,11.24 | IC2.6 v16.91,13.57 | 41.86,2.87 40.43,3.04 | J1.5 38.73,41.95 | 32.27,33.83 32.75,33.43 | IC2.12 15.88,18.33 16.57,17.53
  Top 0.6: IC2.54 1.75,9.6 0.16,10.64 0.16,15.88 0.16,19.84 0.08,30.4 | 16.21,40.92 16.11,43.81 15.4,44.29 | 15.4,44.29 14.6,45.09 3.17,45.09 | 3.17,45.09 2.06,45.01 1.19,44.05 1.27,30.48 | SV1.10 3.17,45.09 | SV1.2 14.6,41.27 16.21,40.92 | 53.66,33.02 53.66,3.81 SV2.4 SV2.3 47.44,2.88 46.64,2.55 | 53.66,33.02 SV3.4 SV3.3 | 53.66,33.02 53.66,44.85 52.63,45.09 32.92,45.12 23.09,45.13 16.19,45.09 15.4,44.29 | LED2.C LED1.C 0.32,5.56 0.32,9.52 v1.35,11.24 | C3.2 C4.2 32.46,4.92 34.57,5.92 | 38.73,41.95 37.32,43.97 34.94,44.05 33.93,44.06 IC4.1 | 16.21,40.92 21.69,40.92 C2.2 | C2.2 C1.2 | 32.27,33.83 30.77,33.83 30.27,33.42 27.78,35.88 27.78,39.85 C2.2
  Top 0.61: 34.57,5.92 35.76,8.53 36.22,9.57
  Top 0.813: IC4.1 32.92,45.12 | IC3.1 23.09,45.13
  Bottom 0.305: v16.91,17.52 v16.91,13.57 v1.35,11.24
MISO
  Top 0.225: 51.72,28.39 51.72,25.97
  Top 0.3: IC5.2 49.87,21.15 53.01,25.24 53.01,28.36 52.86,28.53 51.88,28.53 51.72,28.39 | IC1.65 45.02,26.84 46.05,26.49 47.14,26.49 48.03,25.53 51.13,25.53 51.72,25.97
MOSI
  Top 0.3: IC1.64 44.89,26.34 46.02,25.92 46.94,25.87 47.78,24.92 51.43,24.92 52.37,25.67 IC5.5
N$1  (via drill 0.6)
  Top 0.25: 40.72,3.83 46.27,3.83
  Top 0.254: Y2.3 38.35,5.35 40.11,5.35 40.72,3.83 | 46.27,3.83 v46.83,3.91
  Top 0.3: IC1.56 45.08,22.33 46.04,22.33 v47.15,22.54
  Bottom 0.25: v47.15,22.54 v46.83,3.91
N$2
  Top 0.25: 6.87,40.66 7.04,40.88
  Top 0.254: 11.91,40.88 12.23,40.58
  Top 0.3: IC1.109 21.35,30.35 16.81,36.19 7.89,36.19 6.87,37.94 6.87,40.66 | 7.04,40.88 11.91,40.88
  Top 0.61: 12.23,40.58 SV1.1
N$3
  Top 0.25: 10.79,38.26 SV1.3
  Top 0.3: IC1.106 25.24,33.99 19.42,35.12 17.2,37.27 12.09,37.27 10.79,37.66
  Top 0.6: 10.79,37.66 10.79,38.26
N$4
  Top 0.3: IC1.107 24.76,33.5 19.15,34.51 16.99,36.71 9.42,36.71 8.41,37.78
  Top 0.6: 8.41,37.78 SV1.5
N$5
  Top 0.3: IC1.110 21.03,29.84 16.59,35.62 4.2,35.62 3.17,37.46
  Top 0.6: 3.17,37.46 SV1.9
N$6
  Top 0.25: IC1.111 20.7,29.37 16.37,35.08 10,35.08 6.25,29.62 IC2.29
N$7
  Top 0.25: IC1.112 20.39,28.82 16.11,34.61 10.27,34.61 6.35,28.82 IC2.30
N$8
  Top 0.25: IC1.114 20.32,27.86 15.89,34.13 10.59,34.13 6.45,28.04 IC2.31
N$9
  Top 0.25: IC1.115 20.08,27.3 15.65,33.66 10.85,33.66 6.55,27.22 IC2.32
N$10
  Top 0.25: IC1.116 19.76,26.83 15.43,33.18 11.12,33.18 6.68,26.42 IC2.33
N$11
  Top 0.25: 33.79,6.88 31.17,5.73 29.51,2.73
  Top 0.254: R2.2 10,1.91 24.45,1.91 29.51,2.73 | 33.79,6.88 34.29,8.1 IC1.21
N$12
  Top 0.25: 29.92,2.35 31.47,5.33 34.12,6.51
  Top 0.254: IC1.22 34.79,8.09 34.12,6.51 | 29.92,2.35 24.61,1.43 9.84,1.43 R3.2
N$13
  Top 0.25: R3.1 LED2.A
N$14
  Top 0.25: R2.1 LED1.A
N$15
  Top 0.25: IC1.117 19.25,26.35 15.22,32.7 11.38,32.7 6.8,25.57 IC2.34
N$16
  Top 0.25: IC2.26 16.45,29.57 18.93,25.83 IC1.118
N$17
  Top 0.25: IC2.25 16.35,28.77 18.73,25.32 IC1.119
N$18
  Top 0.25: IC2.24 16.05,28.07 18.49,24.84 IC1.120
N$19
  Top 0.25: IC2.23 16.05,27.27 18.23,24.37 IC1.121
N$20
  Top 0.25: IC2.22 14.67,26.35 16.03,26.35 18.04,23.82 19.64,23.82 21.2,23.37 IC1.123
N$21
  Top 0.25: 45.05,7.02 TP1.TP
  Top 0.254: 45.05,7.02 44.57,7.58 44.53,8.98 43.86,10.28 R1.1 | 43.86,12.59 IC1.37
  Top 0.3: 43.86,10.28 43.86,12.59
N$22
  Top 0.25: IC2.21 15.88,25.56 17.84,23.32 19.45,23.32 21.04,22.82 IC1.124
N$23
  Top 0.25: IC2.20 15.88,24.77 17.67,22.83 19.38,22.83 20.04,22.12 21.04,22.12 21.42,21.85 IC1.126
N$24
  Top 0.25: IC2.19 15.88,23.97 17.47,22.33 19.17,22.33 19.74,21.62 20.89,21.62 21.38,21.33 IC1.127
N$25
  Top 0.25: IC2.18 16.02,23.18 17.76,20.59 19.54,19.47 21.22,19.47 21.34,19.37 IC1.131
N$26
  Top 0.25: IC2.17 15.97,22.43 17.38,20.11 19.52,18.97 21.12,18.97 21.29,18.87 IC1.132
N$27
  Top 0.25: IC2.16 15.88,21.59 16.97,19.7 19.6,18.43 20.92,18.42 21.07,18.34 IC1.133
N$28
  Top 0.25: IC2.15 15.82,20.8 16.57,19.38 19.55,17.88 IC1.134
N$29
  Top 0.25: IC2.13 15.88,19.21 17.77,18.23 17.77,16.33 20.77,16.33 IC1.137
N$30
  Top 0.25: IC1.138 17.7,15.83 16.2,16.69 15.65,17.63 IC2.11
N$31
  Top 0.25: 17.38,15.35 IC1.139 | IC2.10 15.6,16.73
  Top 0.254: 15.6,16.73 15.95,16.22 17.38,15.35
N$32
  Top 0.25: IC2.8 16.11,14.92 18.67,14.86 IC1.140
N$33
  Top 0.25: IC2.7 16.19,14.45 17.4,14.41 IC1.141
N$34
  Top 0.25: IC2.5 15.79,12.7 17.57,12.73 19.37,13.86 IC1.142
N$35
  Top 0.25: IC2.4 17.51,11.96 19.78,13.34 IC1.143
N$36
  Top 0.25: IC2.35 4.55,24.77 12.7,20.04 12.7,9.21 13.81,8.1 21.59,8.1 24.76,9.84 IC1.2
N$37
  Top 0.25: IC2.36 4.6,24.07 12.22,19.6 12.22,8.89 13.65,7.62 21.75,7.62 25.54,7.89 26.27,9.23 IC1.5
N$38
  Top 0.25: IC2.37 4.75,23.22 11.75,19.23 11.75,8.73 13.34,7.14 21.91,7.14 25.87,7.47 26.77,9.23 IC1.6
N$39
  Top 0.25: IC2.38 5,22.47 11.27,18.89 11.27,8.57 13.02,6.67 22.22,6.67 26.2,7 27.27,9.03 IC1.7
N$40
  Top 0.25: IC2.39 5.05,21.72 10.79,18.57 10.79,8.41 12.7,6.19 22.38,6.19 26.52,6.53 27.77,8.93 IC1.8
N$41
  Top 0.25: 40.8,6.27 TP3.TP
  Top 0.254: IC1.32 39.75,9.25 R4.1 40.8,7.46 40.8,6.27
N$42
  Top 0.25: IC2.42 6.97,19.21 10.32,10.61 10.32,8.25 12.38,5.71 22.7,5.71 26.8,6.07 28.27,8.83 IC1.9
N$43
  Top 0.25: IC2.44 7.05,17.72 9.84,10.48 9.84,8.1 12.06,5.24 23.02,5.24 27.07,5.65 28.77,8.73 IC1.10
N$44
  Top 0.25: IC2.45 6.8,16.92 9.37,10.32 9.37,7.94 11.7,4.76 23.29,4.76 27.46,5.23 29.27,8.63 IC1.11
N$45
  Top 0.25: IC2.47 5.8,15.22 8.89,10.16 8.89,7.78 11.43,4.29 23.65,4.29 27.79,4.81 29.75,8.49 IC1.12
N$46
  Top 0.25: IC2.53 6.35,10.42 6.88,9.38 6.98,7.14 10.16,2.38 24.41,2.38 29.16,3.14 | IC1.17 32.28,9.84 32.09,9.42 32.09,8.52
  Top 0.254: 32.09,8.52 29.16,3.14
N$47
  Top 0.25: IC2.51 5.95,12.12 7.46,9.56 7.46,7.3 10.42,2.86 24.13,2.86 28.84,3.56 | 31.56,8.56 31.54,9.37 31.77,9.82 IC1.16
  Top 0.254: 31.56,8.56 28.84,3.56
N$48
  Top 0.25: IC2.50 6,13.12 7.94,9.77 7.94,7.46 10.79,3.33 23.97,3.33 28.47,3.98 | 30.98,8.59 30.99,9.32 31.24,9.77 IC1.15
  Top 0.254: 30.98,8.59 28.47,3.98
N$49
  Top 0.25: IC2.48 5.75,14.42 8.41,9.94 8.41,7.62 11.17,3.81 23.81,3.81 28.1,4.4 | 30.39,8.62 30.39,9.32 30.77,9.87 IC1.14
  Top 0.254: 30.39,8.62 28.1,4.4
N$50
  Top 0.25: 3.45,15.07 3.85,15.07
N$52
  Top 0.25: 47.62,35.56 SV3.5
  Top 0.3: IC1.74 41.27,33.17 41.55,33.57 44.61,34.18 47.29,35.57
  Top 0.6: 47.29,35.57 47.62,35.56
N$53
  Top 0.3: IC1.75 40.77,33.3 41.22,34.07 44.45,34.66 47.47,36.83 50.24,36.83 50.45,36.62
  Top 0.6: 50.45,36.62 SV3.6
N$54
  Top 0.25: 47.62,38.1 SV3.7
  Top 0.3: IC1.78 39.27,35.22 44.24,35.22 47.34,38.07
  Top 0.6: 47.34,38.07 47.62,38.1
N$55
  Top 0.3: IC1.79 38.77,35.72 44.07,35.72 47.42,39.37 50.24,39.37 50.39,39.17
  Top 0.6: 50.39,39.17 SV3.8
N$56
  Top 0.25: 47.78,40.64 SV3.9
  Top 0.3: IC1.80 38.27,36.22 43.84,36.22 47.29,40.62
  Top 0.6: 47.29,40.62 47.78,40.64
N$57
  Top 0.3: IC1.82 37.27,37.22 43.3,37.22 47.31,43.02
  Top 0.6: 47.31,43.02 SV3.11
N$58
  Top 0.3: IC1.81 37.77,36.72 43.55,36.72 47.37,41.91 50.24,41.91 50.45,41.77
  Top 0.6: 50.45,41.77 SV3.10
N$59
  Top 0.3: IC1.83 36.77,37.72 43.05,37.72 47.15,44.45 50.24,44.45 50.45,44.27
  Top 0.6: 50.45,44.27 SV3.12
N$60
  Top 0.3: IC1.39 44.92,13.84 45.49,13.12 45.49,9.37 46.67,7.94 47.47,6.35 47.64,6.32
  Top 0.6: 47.64,6.32 SV2.5
N$61
  Top 0.3: IC1.40 45.14,14.34 46.05,13.27 46.05,9.57 46.99,8.57 47.39,7.62 50.16,7.62 50.54,7.42
  Top 0.6: 50.54,7.42 SV2.6
N$62
  Top 0.3: IC1.41 45.34,14.84 46.55,13.57 46.55,9.77 47.54,9.22
  Top 0.6: 47.54,9.22 SV2.7
N$63
  Top 0.25: 45.59,16.22 45.27,15.82
  Top 0.3: 45.59,16.22 46.99,16.22 47.15,15.95 47.15,10.45 47.47,10.16 50.32,10.16 50.49,9.97 | 45.27,15.82 IC1.43
  Top 0.6: 50.49,9.97 SV2.8
N$64
  Top 0.25: 45.02,16.34 45.42,16.72
  Top 0.3: IC1.44 45.02,16.34 | 45.42,16.72 47.24,16.72 47.67,16.12 47.67,12.54 47.79,12.37
  Top 0.6: 47.79,12.37 SV2.9
N$65
  Top 0.25: 44.69,17.34 45.17,17.72
  Top 0.3: 44.69,17.34 IC1.46 | 45.17,17.72 47.7,17.72 49.39,15.84 50.21,15.58 50.21,12.7 50.54,12.42
  Top 0.6: 50.54,12.42 SV2.10
N$66
  Top 0.25: 44.84,16.84 45.3,17.22
  Top 0.3: 44.84,16.84 IC1.45 | 45.3,17.22 47.49,17.22 48.89,15.55 48.89,15.27
  Top 0.6: 48.89,15.27 SV2.11
N$67
  Top 0.25: 44.57,17.84 45.05,18.22
  Top 0.3: 44.57,17.84 IC1.47 | 45.05,18.22 47.89,18.22 49.79,16.28 51.28,15.81 51.44,15.65 51.45,15.42
  Top 0.6: 51.45,15.42 SV2.12
N$68
  Top 0.25: IC1.1 24.29,10.1 21.35,8.57 16.51,8.57 15.72,10.32 IC2.2
VCC
  Top 0.406: J1.1 41.43,38.89 | 24.45,44.13 arc99 24.33,43.81
  Top 0.6: 41.43,38.89 40.94,38.42 35.24,38.42 29.45,42.23 | IC4.3 26.83,44.13 24.45,44.13 | 24.33,43.81 24.3,42.53 23.51,42.11 19.38,42.11 IC3.3
  Top 0.61: 29.45,42.23 IC4.3
VCCINT  (via drill 0.6)
  Top 0.25: IC1.128 20.55,20.85
  Top 0.254: IC1.89 33.81,33.58 | IC1.52 45.08,20.32
  Top 0.3: 20.55,20.85 v20.32,20.78 | v32.97,8.84 33.26,9.52 IC1.19 | 45.08,20.32 v45.48,19.9 | 37.78,9.52 IC1.28
  Top 0.406: 33.81,33.58 v34.53,34.37
  Top 0.6: v34.53,34.37 34.53,35 34.53,36.91 IC4.4 | 27.15,42.07 27.15,42.86 C2.1
  Top 0.61: 37.78,9.52 v37.46,8.89 37.16,8.65 36.92,8.13 36.28,6.97 C4.1 | IC4.4 30.64,39.21 27.15,42.07
  Bottom 0.3: 20.32,21.59 v20.32,20.78
  Bottom 0.61: v20.32,20.78 v32.97,8.84 v37.46,8.89 | 20.32,21.59 v34.53,34.37 v45.48,19.9
(copper drawn outside any net)
  shapes: Top area x49